# EAGLE design gloBrdB (EAGLE 6.4)
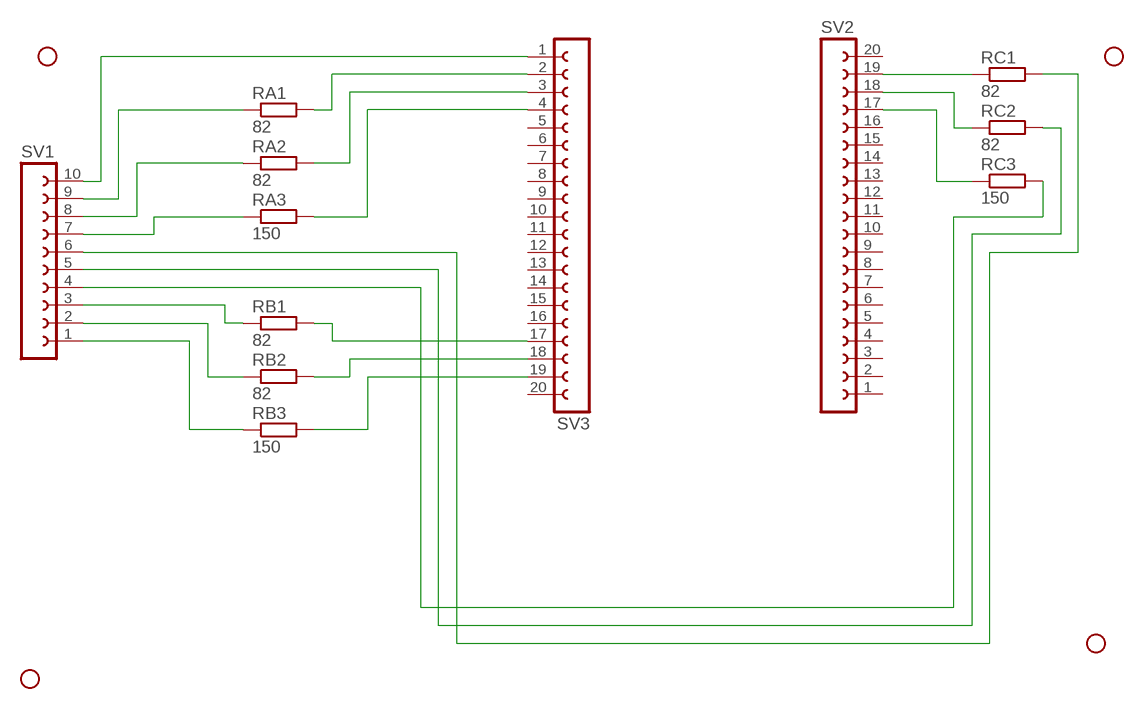
[diagram p0: schematic, sheet 1]

## Parts
RA1  82  R-EU_0204/7  [0204/7]
RA2  82  R-EU_0204/7  [0204/7]
RA3  150  R-EU_0204/7  [0204/7]
RB1  82  R-EU_0204/7  [0204/7]
RB2  82  R-EU_0204/7  [0204/7]
RB3  150  R-EU_0204/7  [0204/7]
RC1  82  R-EU_0204/7  [0204/7]
RC2  82  R-EU_0204/7  [0204/7]
RC3  150  R-EU_0204/7  [0204/7]
STANDOFF1  STAND-OFF  [STAND-OFF]
STANDOFF2  STAND-OFF  [STAND-OFF]
STANDOFF3  STAND-OFF  [STAND-OFF]
STANDOFF4  STAND-OFF  [STAND-OFF]
SV1  FE10-1  [FE10]
SV2  FE20-1  [FE20]
SV3  FE20-1  [FE20]

## Nets
N$1: SV1.10 SV3.1
N$2: RA1.2 SV3.2
N$3: RA2.2 SV3.3
N$4: RA3.2 SV3.4
N$5: RB3.2 SV3.19
N$6: RB2.2 SV3.18
N$7: RB1.2 SV3.17
N$8: RC3.2 SV1.4
N$9: RC2.2 SV1.5
N$10: RC1.2 SV1.6
N$11: RC1.1 SV2.19
N$12: RC2.1 SV2.18
N$13: RC3.1 SV2.17
N$14: RA1.1 SV1.9
N$16: RA2.1 SV1.8
N$17: RA3.1 SV1.7
N$18: RB1.1 SV1.3
N$19: RB2.1 SV1.2
N$20: RB3.1 SV1.1
Unconnected: SV2.1 SV2.2 SV2.3 SV2.4 SV2.5 SV2.6 SV2.7 SV2.8 SV2.9 SV2.10 SV2.11 SV2.12 SV2.13 SV2.14 SV2.15 SV2.16 SV2.20 SV3.5 SV3.6 SV3.7 SV3.8 SV3.9 SV3.10 SV3.11 SV3.12 SV3.13 SV3.14 SV3.15 SV3.16 SV3.20

## Library data of the parts
RA1-RA3 RB1-RB3 RC1-RC3 = resistor:R-EU_: RESISTOR, European symbol
STANDOFF1-STANDOFF4 = SparkFun-Electromechanical:STAND-OFF: #4 Stand Off This is the mechanical footprint for a #4 phillips button head screw. Use the keepout ring to avoid running the screw head into surrounding components. SKU : PRT-00447
SV1 = con-lsta:FE10-1: FEMALE HEADER; OC_FARNELL: unknown; OC_NEWARK: unknown
SV2 SV3 = con-lsta:FE20-1: FEMALE HEADER; OC_FARNELL: unknown; OC_NEWARK: unknown

## Board
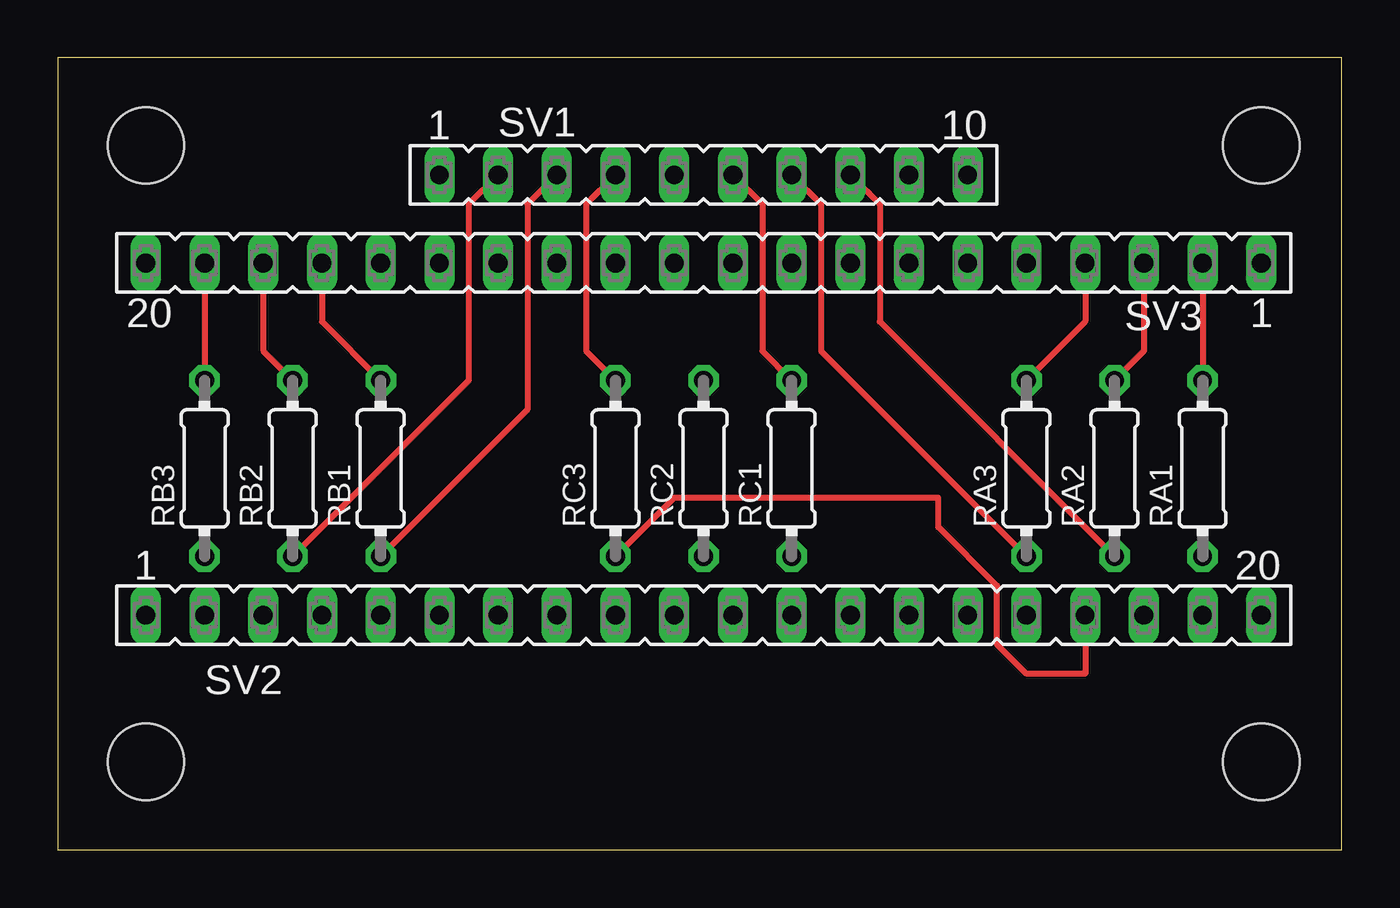
[diagram p1: board, top side]
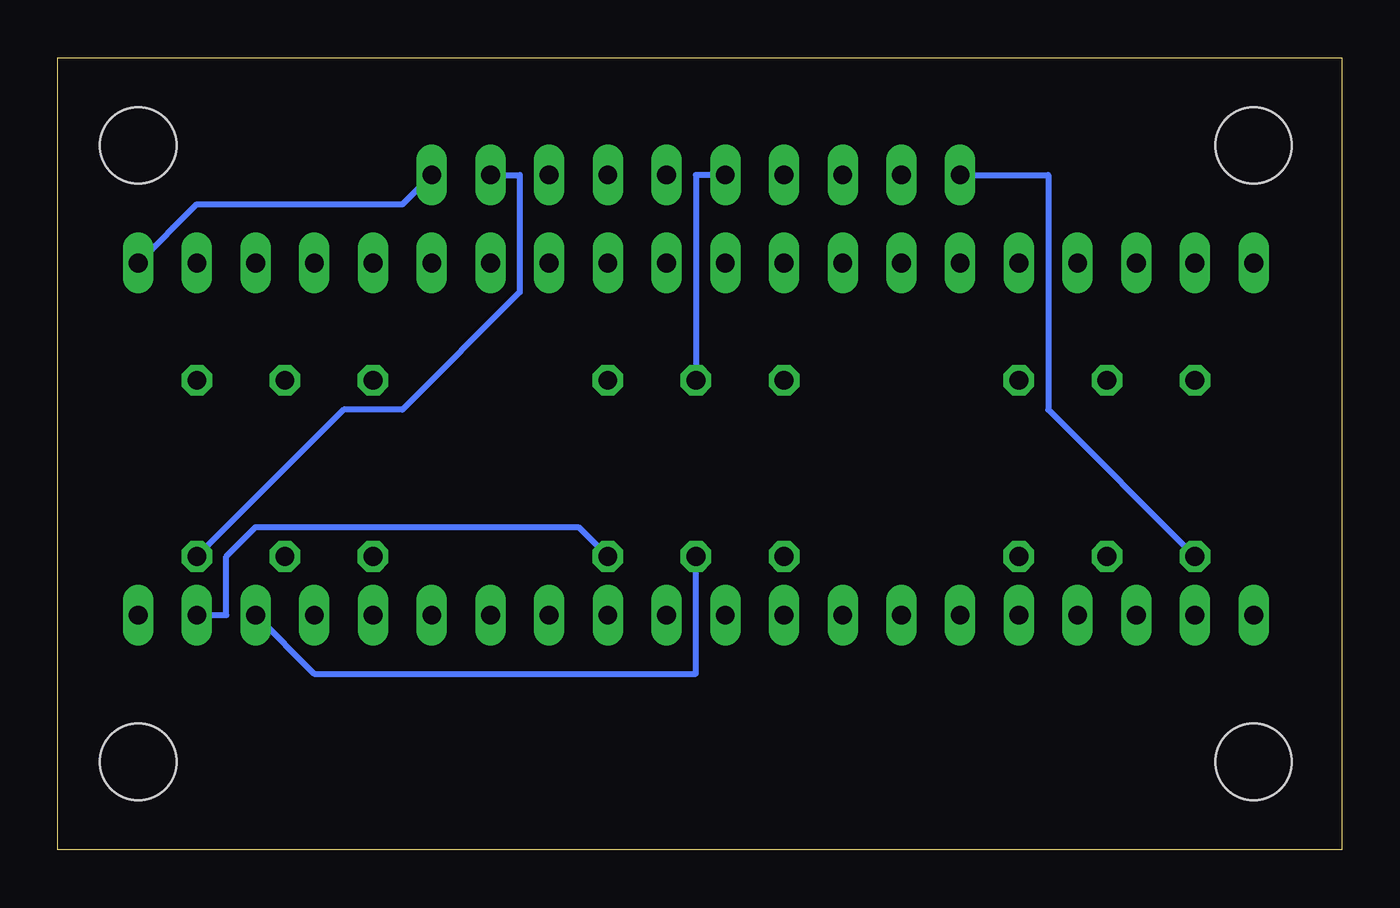
[diagram p2: board, bottom side, seen from below]

Size 55.55 x 34.28 mm. Coordinates in mm from the lower left corner, seen from the top.
Outline: 0,0 55.55,0 55.55,34.28 0,34.28 0,0
Copper layers (1*16): Top 0.035mm / dielectric 1.5mm / Bottom 0.035mm
Design rules "default": minimum track width 10mil, minimum drill 24mil, track to track 8mil, track to pad 8mil, pad to pad 8mil, via to via 8mil, smd to smd 8mil, copper to edge 40mil, drill to drill 8mil, minimum pad ring 10mil, minimum via ring 8mil, stop-mask expansion 4mil, vias tented up to drill 0mil, thermal gap 10mil

### Footprints (pad centres in the part's own frame; a part is rotated, then mirrored left to right if it is on the bottom)
0204/7 = drill 0.813 octagon: 1 -3.81,0; 2 3.81,0
STAND-OFF = hole 3.302: 0,0
FE10 = drill 0.813 long: 1 -11.43,0; 2 -8.89,0; 3 -6.35,0; 4 -3.81,0; 5 -1.27,0; 6 1.27,0; 7 3.81,0; 8 6.35,0; 9 8.89,0; 10 11.43,0
FE20 = drill 0.813 long: 1 -24.13,0; 2 -21.59,0; 3 -19.05,0; 4 -16.51,0; 5 -13.97,0; 6 -11.43,0; 7 -8.89,0; 8 -6.35,0; 9 -3.81,0; 10 -1.27,0; 11 1.27,0; 12 3.81,0; 13 6.35,0; 14 8.89,0; 15 11.43,0; 16 13.97,0; 17 16.51,0; 18 19.05,0; 19 21.59,0; 20 24.13,0

### Placement (x,y rotation side)
RA1  49.53,16.51 90 top
RA2  45.72,16.51 90 top
RA3  41.91,16.51 90 top
RB1  13.97,16.51 90 top
RB2  10.16,16.51 90 top
RB3  6.35,16.51 90 top
RC1  31.75,16.51 90 top
RC2  27.94,16.51 90 top
RC3  24.13,16.51 90 top
STANDOFF1  3.81,30.48 0 top
STANDOFF2  52.07,30.48 0 top
STANDOFF3  3.81,3.81 0 top
STANDOFF4  52.07,3.81 0 top
SV1  27.94,29.21 0 top
SV2  27.94,10.16 0 top
SV3  27.94,25.4 180 top

### Tracks (layer width: path | path; a pad name or v marks a point on that pad's centre or on a via)
N$1
  Bottom 0.254: SV1.10 40.64,27.94 49.53,27.94 SV3.1
N$2
  Top 0.254: SV3.2 RA1.2
N$3
  Top 0.254: RA2.2 46.99,21.59 SV3.3
N$4
  Top 0.254: RA3.2 44.45,22.86 SV3.4
N$5
  Top 0.254: SV3.19 RB3.2
N$6
  Top 0.254: RB2.2 8.89,21.59 SV3.18
N$7
  Top 0.254: RB1.2 11.43,22.86 SV3.17
N$8
  Top 0.254: RC3.2 22.86,21.59 22.86,27.94 SV1.4
N$9
  Bottom 0.254: RC2.2 27.94,29.21 SV1.5
N$10
  Top 0.254: RC1.2 30.48,21.59 30.48,27.94 SV1.6
N$11
  Bottom 0.254: RC1.1 33.02,13.97 46.99,13.97 48.26,12.7 48.26,10.16 SV2.19
N$12
  Bottom 0.254: RC2.1 27.94,7.62 44.45,7.62 SV2.18
N$13
  Top 0.254: RC3.1 26.67,15.24 38.1,15.24 38.1,13.97 40.64,11.43 40.64,8.89 41.91,7.62 44.45,7.62 SV2.17
N$14
  Bottom 0.254: RA1.1 43.18,19.05 40.64,19.05 35.56,24.13 35.56,29.21 SV1.9
N$16
  Top 0.254: RA2.1 35.56,22.86 35.56,27.94 SV1.8
N$17
  Top 0.254: RA3.1 33.02,21.59 33.02,27.94 SV1.7
N$18
  Top 0.254: RB1.1 20.32,19.05 20.32,27.94 SV1.3
N$19
  Top 0.254: RB2.1 17.78,20.32 17.78,27.94 SV1.2
N$20
  Bottom 0.254: RB3.1 12.7,19.05 12.7,29.21 SV1.1

### Text on the board
tValues: RGB GlowCube - James Sutton 2013 | jsutton.co.uk